# Altium schematic sheet Microcontroller.SchDoc
size A4
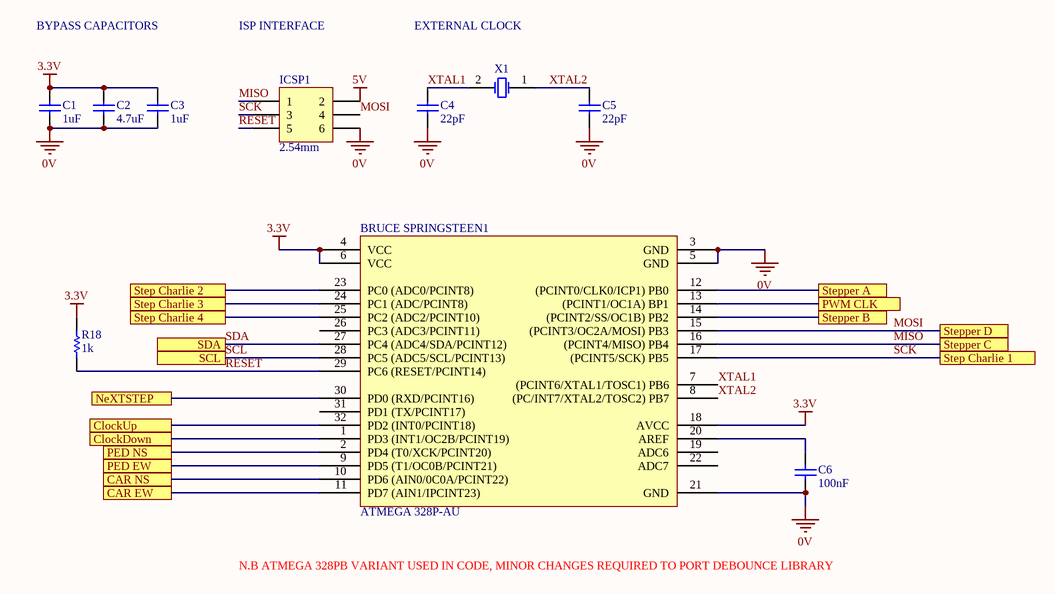
[diagram p0: Microcontroller.SchDoc]

## Parts
BRUCE_SPRINGSTEEN1  ATMEGA 328P-AU  [ATMEL TQFP-32]
C1  1uF  [0805]
C2  4.7uF  [0805]
C3  1uF  [0805]
C4  22pF  [0805]
C5  22pF  [0805]
C6  100nF  [0805]
ICSP1  2.54mm  [Header 2x3]
R18  1k  [0805]
X1  (no value)  [Abracon HC-49/US]

## Ports
CAR EW, CAR NS, ClockDown, ClockUp, NeXTSTEP, PED EW, PED NS, PWM CLK, SCL, SDA, Step Charlie 1, Step Charlie 2, Step Charlie 3, Step Charlie 4, Stepper A, Stepper B, Stepper C, Stepper D

## Nets
0V: BRUCE_SPRINGSTEEN1.3(GND) BRUCE_SPRINGSTEEN1.5(GND) BRUCE_SPRINGSTEEN1.21(GND) C1.1 C2.1 C3.1 C4.1 C5.1 C6.1 ICSP1.6
3.3V: BRUCE_SPRINGSTEEN1.4(VCC) BRUCE_SPRINGSTEEN1.6(VCC) BRUCE_SPRINGSTEEN1.18(AVCC) C1.2 C2.2 C3.2 R18.2
5V: ICSP1.2
CAR EW: BRUCE_SPRINGSTEEN1.11(PD7_(AIN1/IPCINT23)) ; port CAR EW
CAR NS: BRUCE_SPRINGSTEEN1.10(PD6_(AIN0/0C0A/PCINT22)) ; port CAR NS
ClockDown: BRUCE_SPRINGSTEEN1.1(PD3_(INT1/OC2B/PCINT19)) ; port ClockDown
ClockUp: BRUCE_SPRINGSTEEN1.32(PD2_(INT0/PCINT18)) ; port ClockUp
MISO: BRUCE_SPRINGSTEEN1.16((PCINT4/MISO)_PB4) ICSP1.1 ; port Stepper C
MOSI: BRUCE_SPRINGSTEEN1.15((PCINT3/OC2A/MOSI)_PB3) ICSP1.4 ; port Stepper D
NeXTSTEP: BRUCE_SPRINGSTEEN1.30(PD0_(RXD/PCINT16)) ; port NeXTSTEP
PED EW: BRUCE_SPRINGSTEEN1.9(PD5_(T1/OC0B/PCINT21)) ; port PED EW
PED NS: BRUCE_SPRINGSTEEN1.2(PD4_(T0/XCK/PCINT20)) ; port PED NS
PWM CLK: BRUCE_SPRINGSTEEN1.13((PCINT1/OC1A)_BP1) ; port PWM CLK
RESET: BRUCE_SPRINGSTEEN1.29(PC6_(RESET/PCINT14)) ICSP1.5 R18.1
SCK: BRUCE_SPRINGSTEEN1.17((PCINT5/SCK)_PB5) ICSP1.3 ; port Step Charlie 1
SCL: BRUCE_SPRINGSTEEN1.28(PC5_(ADC5/SCL/PCINT13)) ; port SCL
SDA: BRUCE_SPRINGSTEEN1.27(PC4_(ADC4/SDA/PCINT12)) ; port SDA
Step Charlie 2: BRUCE_SPRINGSTEEN1.23(PC0_(ADC0/PCINT8)) ; port Step Charlie 2
Step Charlie 3: BRUCE_SPRINGSTEEN1.24(PC1_(ADC/PCINT8)) ; port Step Charlie 3
Step Charlie 4: BRUCE_SPRINGSTEEN1.25(PC2_(ADC2/PCINT10)) ; port Step Charlie 4
Stepper A: BRUCE_SPRINGSTEEN1.12((PCINT0/CLK0/ICP1)_PB0) ; port Stepper A
Stepper B: BRUCE_SPRINGSTEEN1.14((PCINT2/SS/OC1B)_PB2) ; port Stepper B
XTAL1: BRUCE_SPRINGSTEEN1.7((PCINT6/XTAL1/TOSC1)_PB6) C4.2 X1.2(OSC2)
XTAL2: BRUCE_SPRINGSTEEN1.8((PC/INT7/XTAL2/TOSC2)_PB7) C5.2 X1.1(OSC1)
NetBRUCE_SPRINGSTEEN1_20: BRUCE_SPRINGSTEEN1.20(AREF) C6.2

Not connected (* = marked no-connect by the designer): BRUCE_SPRINGSTEEN1 19(ADC6) 22(ADC7) 26(PC3_(ADC3/PCINT11)) 31(PD1_(TX/PCINT17))

## Notes on the sheet
- BYPASS CAPACITORS
- ISP INTERFACE
- EXTERNAL CLOCK
- N.B ATMEGA 328PB VARIANT USED IN CODE, MINOR CHANGES REQUIRED TO PORT DEBOUNCE LIBRARY
- Title
- Size:
- Date:
- A4
- Number:
- Time:
- Revision:
- Sheet
- of
- File:

## Library data of the parts
BRUCE_SPRINGSTEEN1 = ATMEGA 328P-AU: AVR AVR® ATmega Microcontroller IC 8-Bit 20MHz 32KB (16K x 16) FLASH 32-TQFP (7x7); Manufacturer: ATMEL; Part Number: ATMEGA 328P-AU; Digikey Part Number: ATMEGA328P-AU-ND; Digikey Link: https://www.digikey.com/product-detail/en/microchip-technology/ATMEGA328P-AU/ATMEGA328P-AU-ND/1832260
C1 C3 = GCM21BR71A105KA37L: Manufacturer: muRata; Tolerance: 10%; Material: X7R; Rated Voltage: 10V; Part Number: GCM21BR71A105KA37L; Value: 1uF
C2 = GCM21BR61A475KA37L: Manufacturer: muRata; Tolerance: 10%; Material: X5R; Rated Voltage: 10V; Part Number: GCM21BR61A475KA37L; Value: 4.7uF
C4 C5 = GCM21B5C1H220JA37L: Manufacturer: muRata; Tolerance: 5%; Material: C0G; Rated Voltage: 50V; Part Number: GCM21B5C1H220JA37L; Value: 22pF
C6 = GCM21BR71E104KA37L: Manufacturer: muRata; Tolerance: 10%; Material: X7R; Rated Voltage: 25V; Part Number: GCM21BR71E104KA37L; Value: 100nF
ICSP1 = Header 2x3: Positions: 6; Angle: 0; Flange: No; Contact: NA; Part Number: Header 2x3; Pitch: 2.54mm; Row Spacing: 2.54mm
R18 = RC0805FR071KL: Manufacturer: YAGEO; Tolerance: 0.01; Rated Voltage: 0.125W; Part Number: RC0805FR071KL; Value: 1k; Material: FR-07; qty: 50
X1 = ABLS-16.000MHZ-B4-T: Manufacturer: Abracon LLC; Load Capacitance: 18pF; ESR: 40R; Part Number: ABLS-16.000MHZ-B4-T; Digikey Part Number: 535-10226-1-ND; Digikey Link: https://www.digikey.com/product-detail/en/abracon-llc/ABLS-16.000MHZ-B4-T/535-10226-1-ND/2184261